# Altium schematic sheet Mem.SchDoc
size 355 x 254 mm; SheetNumber: 0; SheetTotal: 0
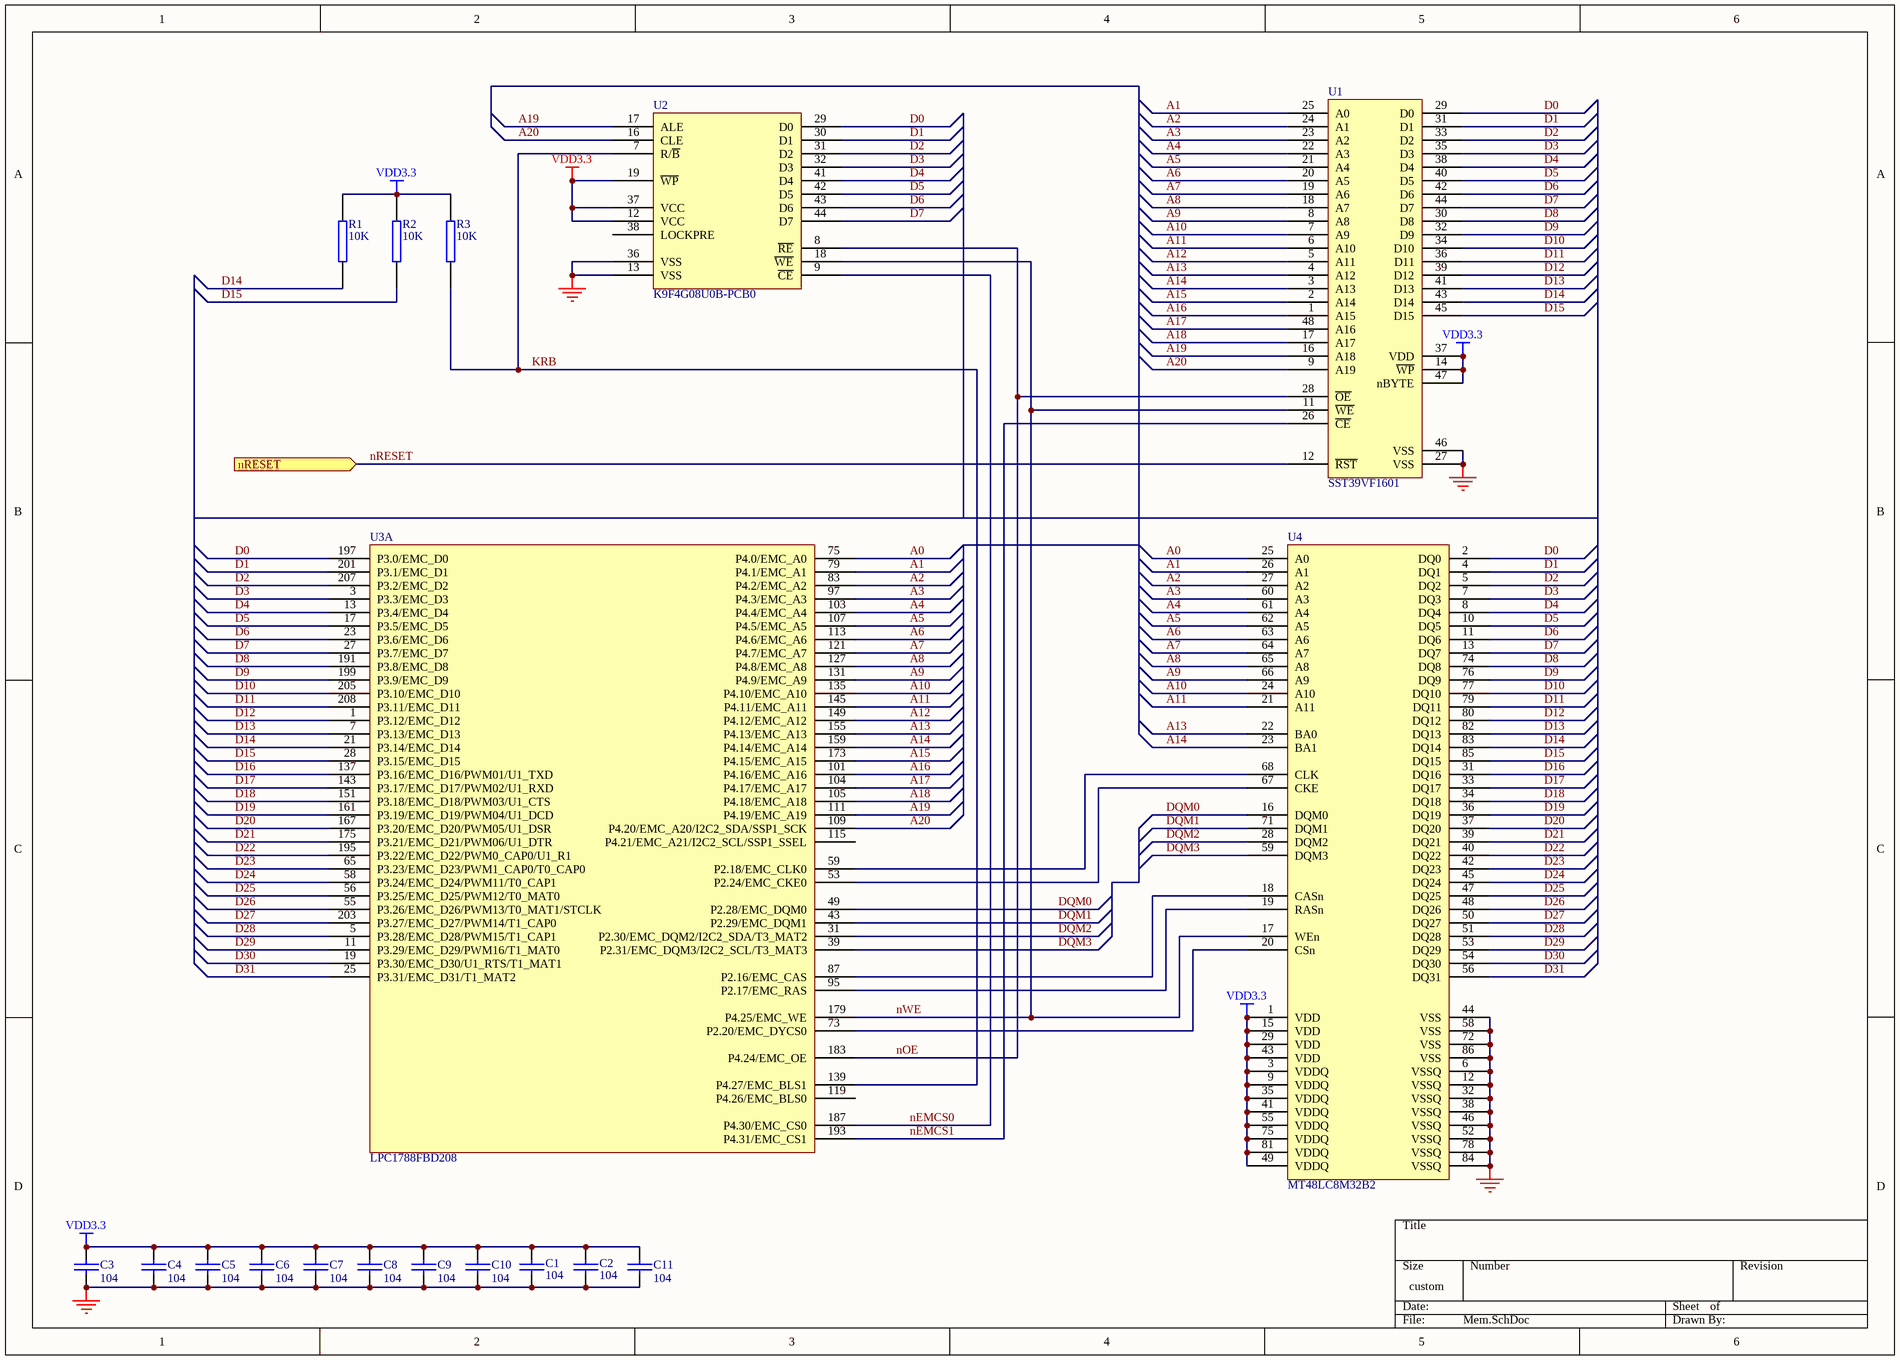
[diagram p0: Mem.SchDoc]

## Parts
C1  104  [C0603]
C2  104  [C0603]
C3  104  [C0603]
C4  104  [C0603]
C5  104  [C0603]
C6  104  [C0603]
C7  104  [C0603]
C8  104  [C0603]
C9  104  [C0603]
C10  104  [C0603]
C11  104  [C0603]
R1  10K  [R0603]
R2  10K  [R0603]
R3  10K  [R0603]
U1  SST39VF1601  [SST39VF1601]
U2  K9F4G08U0B-PCB0  [K9F4G08U0B]
U3  LPC1788FBD208  [QFP208]  (part A of 8)
U4  MT48LC8M32B2  [TSOP86]

## Ports
nRESET (in)

## Nets
GND: C1.2 C2.2 C3.2 C4.2 C5.2 C6.2 C7.2 C8.2 C9.2 C10.2 C11.2 U1.27(VSS) U1.46(VSS) U2.13(VSS) U2.36(VSS) U4.6(VSSQ) U4.12(VSSQ) U4.32(VSSQ) U4.38(VSSQ) U4.44(VSS) U4.46(VSSQ) U4.52(VSSQ) U4.58(VSS) U4.72(VSS) U4.78(VSSQ) U4.84(VSSQ) U4.86(VSS)
NC: U1.10(NC) U1.13(NC) U1.15(NC) U2.1(NC) U2.2(NC) U2.3(NC) U2.4(NC) U2.5(NC) U2.6(NC) U2.10(NC) U2.11(NC) U2.14(NC) U2.15(NC) U2.20(NC) U2.21(NC) U2.22(NC) U2.23(NC) U2.24(NC) U2.25(NC) U2.26(NC) U2.27(NC) U2.28(NC) U2.33(NC) U2.34(NC) U2.35(NC) U2.39(NC) U2.40(NC) U2.45(NC) U2.46(NC) U2.47(NC) U2.48(NC) U4.14(NC) U4.30(NC) U4.57(NC) U4.69(NC) U4.70(NC) U4.73(NC)
VDD3.3: C1.1 C2.1 C3.1 C4.1 C5.1 C6.1 C7.1 C8.1 C9.1 C10.1 C11.1 R1.2 R2.2 R3.2 U1.14(~{WP}) U1.37(VDD) U1.47(nBYTE) U2.12(VCC) U2.19(~{WP}) U2.37(VCC) U4.1(VDD) U4.3(VDDQ) U4.9(VDDQ) U4.15(VDD) U4.29(VDD) U4.35(VDDQ) U4.41(VDDQ) U4.43(VDD) U4.49(VDDQ) U4.55(VDDQ) U4.75(VDDQ) U4.81(VDDQ)
A0: U3.75(P4.0/EMC_A0) U4.25(A0)
A1: U1.25(A0) U3.79(P4.1/EMC_A1) U4.26(A1)
A2: U1.24(A1) U3.83(P4.2/EMC_A2) U4.27(A2)
A3: U1.23(A2) U3.97(P4.3/EMC_A3) U4.60(A3)
A4: U1.22(A3) U3.103(P4.4/EMC_A4) U4.61(A4)
A5: U1.21(A4) U3.107(P4.5/EMC_A5) U4.62(A5)
A6: U1.20(A5) U3.113(P4.6/EMC_A6) U4.63(A6)
A7: U1.19(A6) U3.121(P4.7/EMC_A7) U4.64(A7)
A8: U1.18(A7) U3.127(P4.8/EMC_A8) U4.65(A8)
A9: U1.8(A8) U3.131(P4.9/EMC_A9) U4.66(A9)
A10: U1.7(A9) U3.135(P4.10/EMC_A10) U4.24(A10)
A11: U1.6(A10) U3.145(P4.11/EMC_A11) U4.21(A11)
A12: U1.5(A11) U3.149(P4.12/EMC_A12)
A13: U1.4(A12) U3.155(P4.13/EMC_A13) U4.22(BA0)
A14: U1.3(A13) U3.159(P4.14/EMC_A14) U4.23(BA1)
A15: U1.2(A14) U3.173(P4.15/EMC_A15)
A16: U1.1(A15) U3.101(P4.16/EMC_A16)
A17: U1.48(A16) U3.104(P4.17/EMC_A17)
A18: U1.17(A17) U3.105(P4.18/EMC_A18)
A19: U1.16(A18) U2.17(ALE) U3.111(P4.19/EMC_A19)
A20: U1.9(A19) U2.16(CLE) U3.109(P4.20/EMC_A20/I2C2_SDA/SSP1_SCK)
D0: U1.29(D0) U2.29(D0) U3.197(P3.0/EMC_D0) U4.2(DQ0)
D1: U1.31(D1) U2.30(D1) U3.201(P3.1/EMC_D1) U4.4(DQ1)
D2: U1.33(D2) U2.31(D2) U3.207(P3.2/EMC_D2) U4.5(DQ2)
D3: U1.35(D3) U2.32(D3) U3.3(P3.3/EMC_D3) U4.7(DQ3)
D4: U1.38(D4) U2.41(D4) U3.13(P3.4/EMC_D4) U4.8(DQ4)
D5: U1.40(D5) U2.42(D5) U3.17(P3.5/EMC_D5) U4.10(DQ5)
D6: U1.42(D6) U2.43(D6) U3.23(P3.6/EMC_D6) U4.11(DQ6)
D7: U1.44(D7) U2.44(D7) U3.27(P3.7/EMC_D7) U4.13(DQ7)
D8: U1.30(D8) U3.191(P3.8/EMC_D8) U4.74(DQ8)
D9: U1.32(D9) U3.199(P3.9/EMC_D9) U4.76(DQ9)
D10: U1.34(D10) U3.205(P3.10/EMC_D10) U4.77(DQ10)
D11: U1.36(D11) U3.208(P3.11/EMC_D11) U4.79(DQ11)
D12: U1.39(D12) U3.1(P3.12/EMC_D12) U4.80(DQ12)
D13: U1.41(D13) U3.7(P3.13/EMC_D13) U4.82(DQ13)
D14: R1.1 U1.43(D14) U3.21(P3.14/EMC_D14) U4.83(DQ14)
D15: R2.1 U1.45(D15) U3.28(P3.15/EMC_D15) U4.85(DQ15)
D16: U3.137(P3.16/EMC_D16/PWM01/U1_TXD) U4.31(DQ16)
D17: U3.143(P3.17/EMC_D17/PWM02/U1_RXD) U4.33(DQ17)
D18: U3.151(P3.18/EMC_D18/PWM03/U1_CTS) U4.34(DQ18)
D19: U3.161(P3.19/EMC_D19/PWM04/U1_DCD) U4.36(DQ19)
D20: U3.167(P3.20/EMC_D20/PWM05/U1_DSR) U4.37(DQ20)
D21: U3.175(P3.21/EMC_D21/PWM06/U1_DTR) U4.39(DQ21)
D22: U3.195(P3.22/EMC_D22/PWM0_CAP0/U1_R1) U4.40(DQ22)
D23: U3.65(P3.23/EMC_D23/PWM1_CAP0/T0_CAP0) U4.42(DQ23)
D24: U3.58(P3.24/EMC_D24/PWM11/T0_CAP1) U4.45(DQ24)
D25: U3.56(P3.25/EMC_D25/PWM12/T0_MAT0) U4.47(DQ25)
D26: U3.55(P3.26/EMC_D26/PWM13/T0_MAT1/STCLK) U4.48(DQ26)
D27: U3.203(P3.27/EMC_D27/PWM14/T1_CAP0) U4.50(DQ27)
D28: U3.5(P3.28/EMC_D28/PWM15/T1_CAP1) U4.51(DQ28)
D29: U3.11(P3.29/EMC_D29/PWM16/T1_MAT0) U4.53(DQ29)
D30: U3.19(P3.30/EMC_D30/U1_RTS/T1_MAT1) U4.54(DQ30)
D31: U3.25(P3.31/EMC_D31/T1_MAT2) U4.56(DQ31)
DQM0: U3.49(P2.28/EMC_DQM0) U4.16(DQM0)
DQM1: U3.43(P2.29/EMC_DQM1) U4.71(DQM1)
DQM2: U3.31(P2.30/EMC_DQM2/I2C2_SDA/T3_MAT2) U4.28(DQM2)
DQM3: U3.39(P2.31/EMC_DQM3/I2C2_SCL/T3_MAT3) U4.59(DQM3)
KRB: R3.1 U2.7(R/~{B}) U3.139(P4.27/EMC_BLS1)
nEMCS0: U2.9(~{CE}) U3.187(P4.30/EMC_CS0)
nEMCS1: U1.26(~{CE}) U3.193(P4.31/EMC_CS1)
nOE: U1.28(~{OE}) U2.8(~{RE}) U3.183(P4.24/EMC_OE)
nRESET: U1.12(~{RST}) ; port nRESET
nWE: U1.11(~{WE}) U2.18(~{WE}) U3.179(P4.25/EMC_WE) U4.17(WEn)
NetU3_53: U3.53(P2.24/EMC_CKE0) U4.67(CKE)
NetU3_59: U3.59(P2.18/EMC_CLK0) U4.68(CLK)
NetU3_73: U3.73(P2.20/EMC_DYCS0) U4.20(CSn)
NetU3_87: U3.87(P2.16/EMC_CAS) U4.18(CASn)
NetU3_95: U3.95(P2.17/EMC_RAS) U4.19(RASn)

Not connected (* = marked no-connect by the designer): U2 38(LOCKPRE); U3 115(P4.21/EMC_A21/I2C2_SCL/SSP1_SSEL) 119(P4.26/EMC_BLS0)

## Library data of the parts
C1-C11 = CAP: Capacitor
R1-R3 = RES2
U2 = K9F5608U0D-PCB0